# Altium schematic sheet DC_MOTOR_CONTROLLER.SchDoc
size A4; SheetNumber: 3; SheetTotal: 7
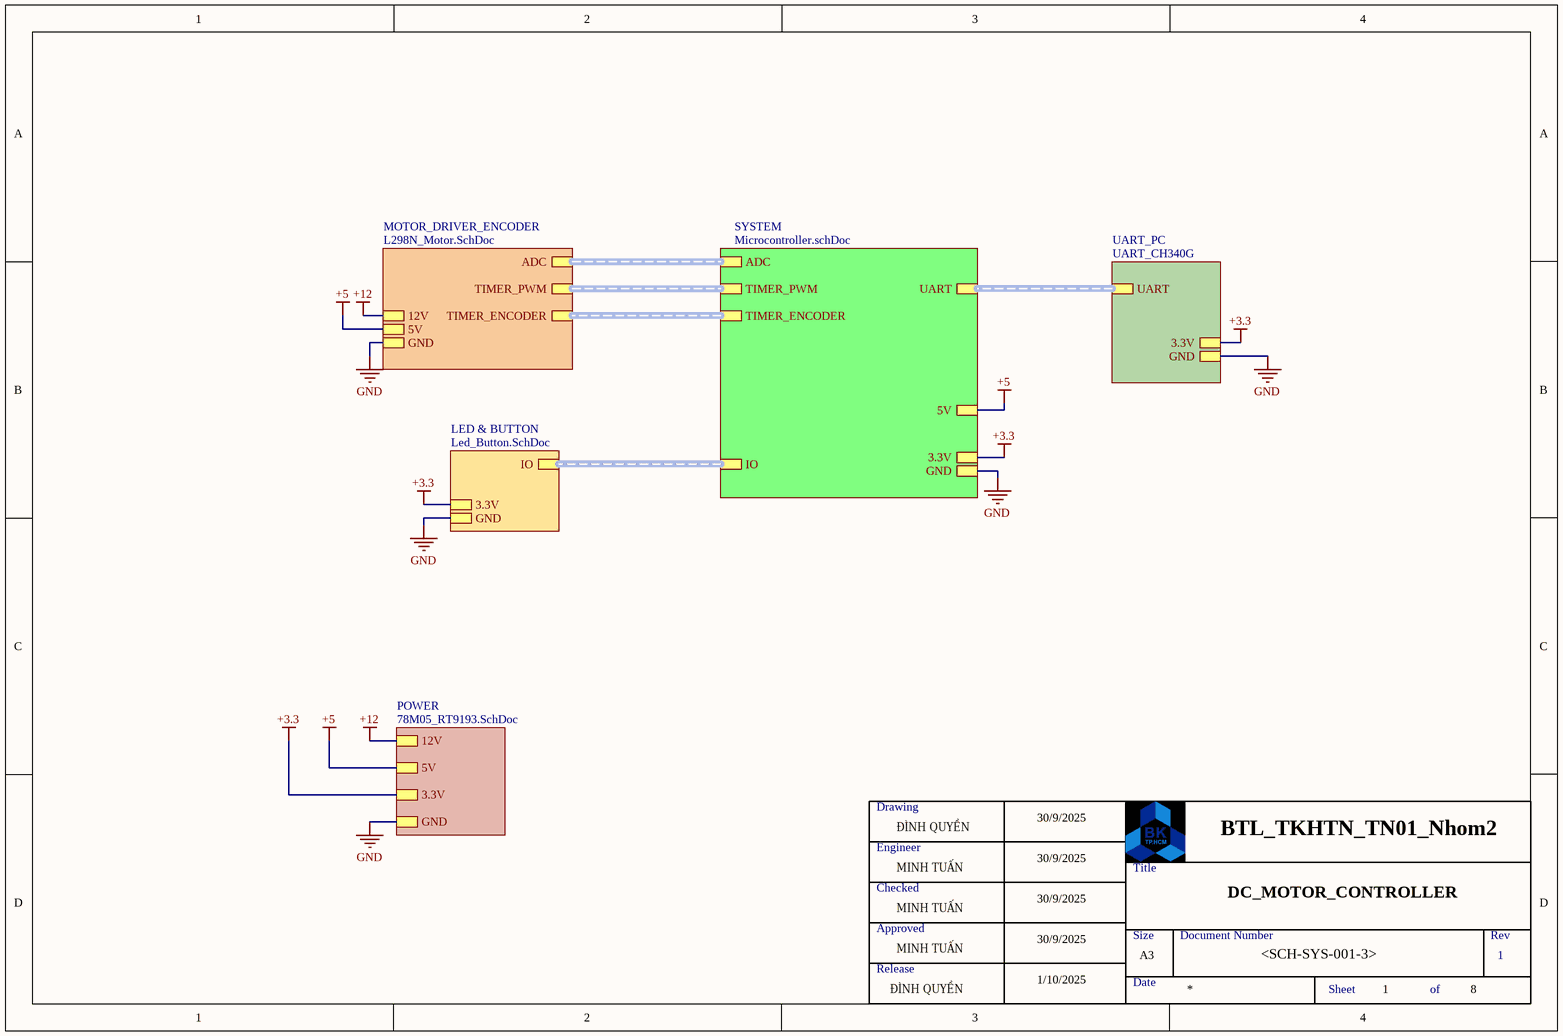
[diagram p0: DC_MOTOR_CONTROLLER.SchDoc]

## Sub-sheets
LED & BUTTON = Led_Button.SchDoc: IO, 3.3V, GND
MOTOR_DRIVER_ENCODER = L298N_Motor.SchDoc: ADC, TIMER_PWM, 12V, 5V, GND, TIMER_ENCODER
POWER = 78M05_RT9193.SchDoc: 5V, 3.3V, GND, 12V
SYSTEM = Microcontroller.schDoc: ADC, TIMER_ENCODER, UART, IO, 3.3V, GND, TIMER_PWM, 5V
UART_PC = UART_CH340G: UART, GND, 3.3V

## Nets
+3.3: sheet SYSTEM/3.3V, sheet LED & BUTTON/3.3V, sheet UART_PC/3.3V, sheet POWER/3.3V
+5: sheet SYSTEM/5V, sheet MOTOR_DRIVER_ENCODER/5V, sheet POWER/5V
+12: sheet MOTOR_DRIVER_ENCODER/12V, sheet POWER/12V
GND: sheet SYSTEM/GND, sheet LED & BUTTON/GND, sheet UART_PC/GND, sheet MOTOR_DRIVER_ENCODER/GND, sheet POWER/GND

## Buses and harness runs
harness sheet LED & BUTTON/IO = sheet SYSTEM/IO
harness sheet MOTOR_DRIVER_ENCODER/ADC = sheet SYSTEM/ADC
harness sheet MOTOR_DRIVER_ENCODER/TIMER_ENCODER = sheet SYSTEM/TIMER_ENCODER
harness sheet MOTOR_DRIVER_ENCODER/TIMER_PWM = sheet SYSTEM/TIMER_PWM
harness sheet SYSTEM/UART = sheet UART_PC/UART

## Notes on the sheet
- Drawing
- Engineer
- ĐÌNH QUYỀN
- 30/9/2025
- BTL_TKHTN_TN01_Nhom2
- Checked
- MINH TUẤN
- Title
- DC_MOTOR_CONTROLLER
- Approved
- Release
- 1/10/2025
- Size
- Date
- A3
- Document Number
- <SCH-SYS-001-3>
- Rev
- 1
- Sheet
- of
- 8